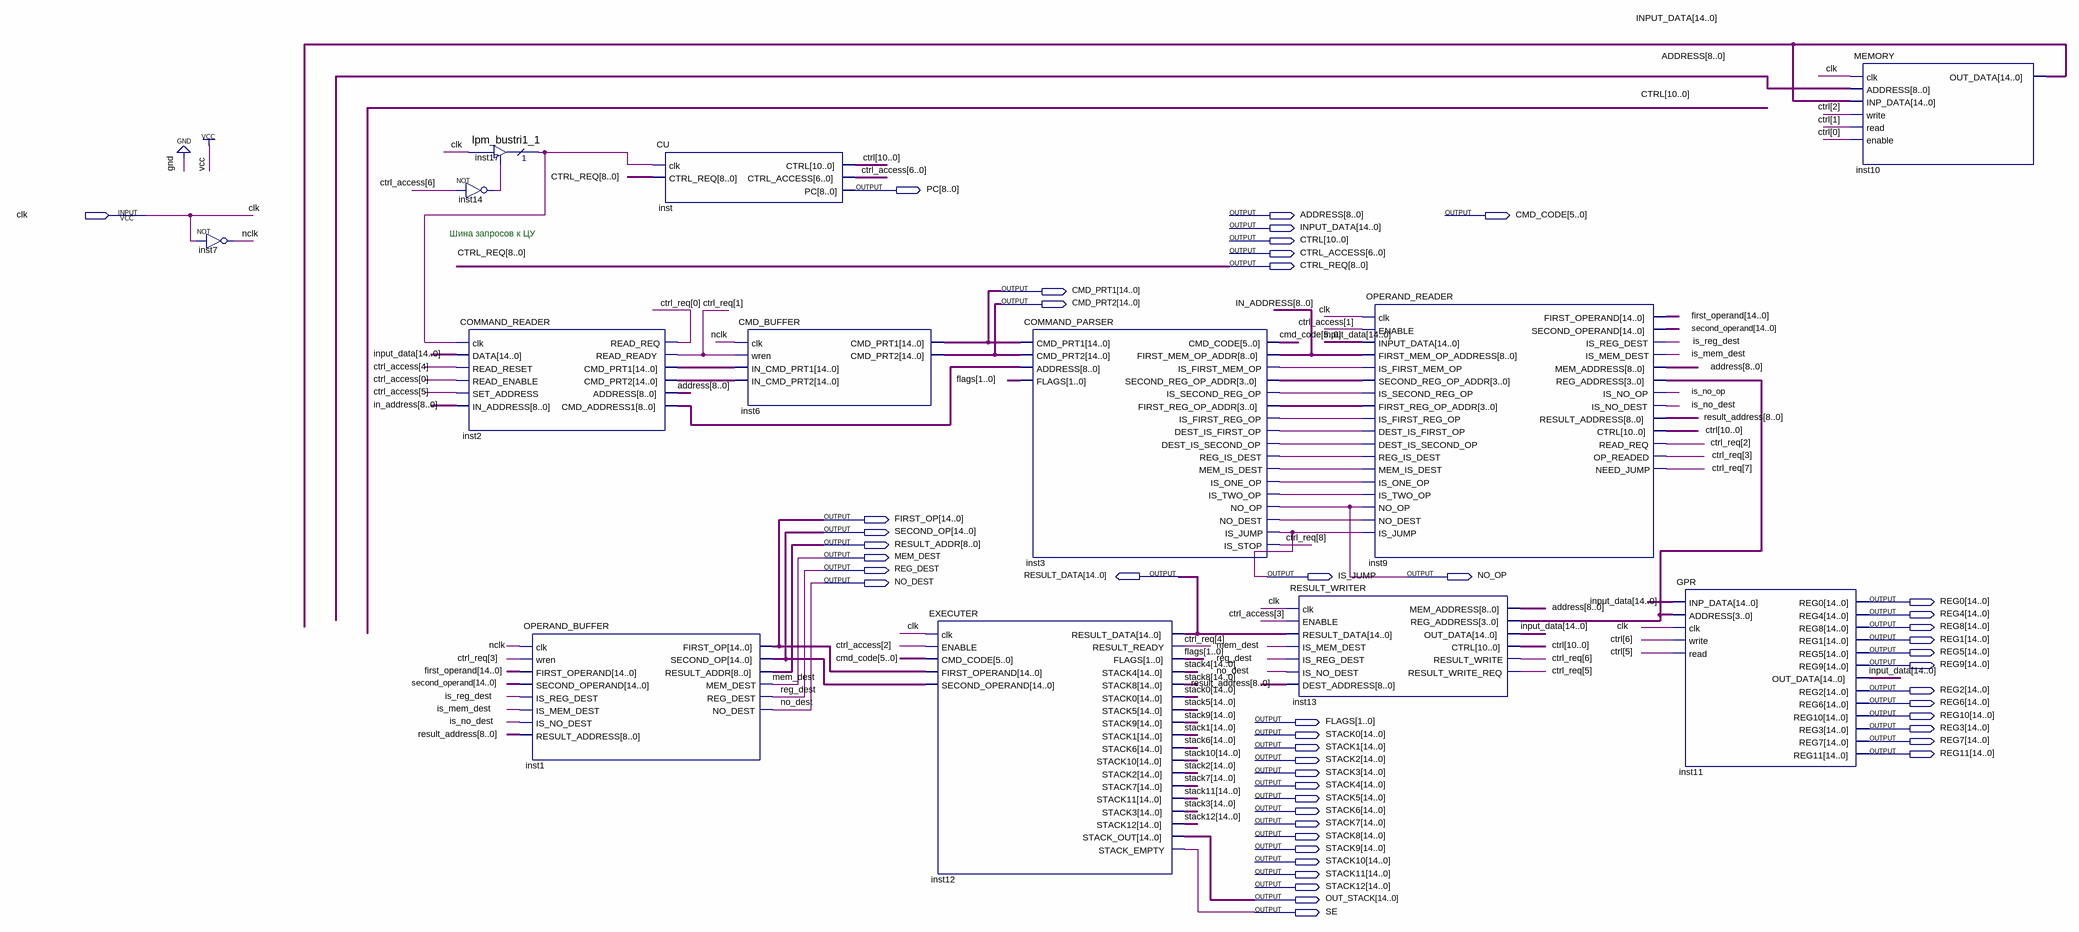
[diagram p0: schematic sheet]
// Quartus schematic MICROPROCESSOR.bdf as structural Verilog: 13 symbols, 47 pins
module MICROPROCESSOR (
  input  clk,
  output [8:0] PC,
  output [8:0] ADDRESS,
  output [5:0] CMD_CODE,
  output [14:0] INPUT_DATA,
  output [10:0] CTRL,
  output [6:0] CTRL_ACCESS,
  output [8:0] CTRL_REQ,
  output [14:0] CMD_PRT1,
  output [14:0] CMD_PRT2,
  output [14:0] FIRST_OP,
  output [14:0] SECOND_OP,
  output [8:0] RESULT_ADDR,
  output MEM_DEST,
  output REG_DEST,
  output [14:0] RESULT_DATA,
  output IS_JUMP,
  output NO_OP,
  output NO_DEST,
  output [14:0] REG0,
  output [14:0] REG4,
  output [14:0] REG8,
  output [14:0] REG1,
  output [14:0] REG5,
  output [14:0] REG9,
  output [14:0] REG2,
  output [14:0] REG6,
  output [14:0] REG10,
  output [1:0] FLAGS,
  output [14:0] REG3,
  output [14:0] STACK0,
  output [14:0] REG7,
  output [14:0] STACK1,
  output [14:0] REG11,
  output [14:0] STACK2,
  output [14:0] STACK3,
  output [14:0] STACK4,
  output [14:0] STACK5,
  output [14:0] STACK6,
  output [14:0] STACK7,
  output [14:0] STACK8,
  output [14:0] STACK9,
  output [14:0] STACK10,
  output [14:0] STACK11,
  output [14:0] STACK12,
  output [14:0] OUT_STACK,
  output SE
);

  wire inst3_dest_is_first_op, inst3_dest_is_second_op, inst3_is_first_mem_op, inst3_is_first_reg_op,
       inst3_is_one_op, inst3_is_second_reg_op, inst3_is_two_op, inst3_mem_is_dest, inst3_no_dest,
       inst3_reg_is_dest, inst14_out, inst17_tridata, is_mem_dest, is_no_dest, is_no_op, is_reg_dest, nclk;
  wire [3:0] inst3_first_reg_op_addr, inst3_second_reg_op_addr, inst13_reg_address;
  wire [8:0] IN_ADDRESS, inst2_cmd_address1, result_address;
  wire [14:0] first_operand, inst2_cmd_prt1, inst2_cmd_prt2, second_operand;

  not inst7 (nclk, clk);
  not inst14 (inst14_out, CTRL_ACCESS[6]);
  COMMAND_READER inst2 (
    .clk(inst17_tridata), .DATA(INPUT_DATA), .READ_RESET(CTRL_ACCESS[4]), .READ_ENABLE(CTRL_ACCESS[0]),
    .SET_ADDRESS(CTRL_ACCESS[5]), .IN_ADDRESS(IN_ADDRESS), .READ_REQ(CTRL_REQ[0]), .READ_READY(CTRL_REQ[1]),
    .CMD_PRT1(inst2_cmd_prt1), .CMD_PRT2(inst2_cmd_prt2), .ADDRESS(ADDRESS), .CMD_ADDRESS1(inst2_cmd_address1));
  lpm_bustri1_1 inst17 (.enabledt(inst14_out), .data(clk), .tridata(inst17_tridata));
  OPERAND_BUFFER inst1 (
    .clk(nclk), .wren(CTRL_REQ[3]), .FIRST_OPERAND(first_operand), .SECOND_OPERAND(second_operand),
    .IS_REG_DEST(is_reg_dest), .IS_MEM_DEST(is_mem_dest), .IS_NO_DEST(is_no_dest),
    .RESULT_ADDRESS(result_address), .FIRST_OP(FIRST_OP), .SECOND_OP(SECOND_OP), .RESULT_ADDR(RESULT_ADDR),
    .MEM_DEST(MEM_DEST), .REG_DEST(REG_DEST), .NO_DEST(NO_DEST));
  CU inst (.clk(inst17_tridata), .CTRL_REQ(CTRL_REQ), .CTRL(CTRL), .CTRL_ACCESS(CTRL_ACCESS), .PC(PC));
  CMD_BUFFER inst6 (
    .clk(nclk), .wren(CTRL_REQ[1]), .IN_CMD_PRT1(inst2_cmd_prt1), .IN_CMD_PRT2(inst2_cmd_prt2),
    .CMD_PRT1(CMD_PRT1), .CMD_PRT2(CMD_PRT2));
  EXECUTER inst12 (
    .clk(clk), .ENABLE(CTRL_ACCESS[2]), .CMD_CODE(CMD_CODE), .FIRST_OPERAND(FIRST_OP),
    .SECOND_OPERAND(SECOND_OP), .RESULT_DATA(RESULT_DATA), .RESULT_READY(CTRL_REQ[4]), .FLAGS(FLAGS),
    .STACK4(STACK4), .STACK8(STACK8), .STACK0(STACK0), .STACK5(STACK5), .STACK9(STACK9), .STACK1(STACK1),
    .STACK6(STACK6), .STACK10(STACK10), .STACK2(STACK2), .STACK7(STACK7), .STACK11(STACK11), .STACK3(STACK3),
    .STACK12(STACK12), .STACK_OUT(OUT_STACK), .STACK_EMPTY(SE));
  COMMAND_PARSER inst3 (
    .CMD_PRT1(CMD_PRT1), .CMD_PRT2(CMD_PRT2), .ADDRESS(inst2_cmd_address1), .FLAGS(FLAGS),
    .CMD_CODE(CMD_CODE), .FIRST_MEM_OP_ADDR(IN_ADDRESS), .IS_FIRST_MEM_OP(inst3_is_first_mem_op),
    .SECOND_REG_OP_ADDR(inst3_second_reg_op_addr), .IS_SECOND_REG_OP(inst3_is_second_reg_op),
    .FIRST_REG_OP_ADDR(inst3_first_reg_op_addr), .IS_FIRST_REG_OP(inst3_is_first_reg_op),
    .DEST_IS_FIRST_OP(inst3_dest_is_first_op), .DEST_IS_SECOND_OP(inst3_dest_is_second_op),
    .REG_IS_DEST(inst3_reg_is_dest), .MEM_IS_DEST(inst3_mem_is_dest), .IS_ONE_OP(inst3_is_one_op),
    .IS_TWO_OP(inst3_is_two_op), .NO_OP(NO_OP), .NO_DEST(inst3_no_dest), .IS_JUMP(IS_JUMP),
    .IS_STOP(CTRL_REQ[8]));
  RESULT_WRITER inst13 (
    .clk(clk), .ENABLE(CTRL_ACCESS[3]), .RESULT_DATA(RESULT_DATA), .IS_MEM_DEST(MEM_DEST),
    .IS_REG_DEST(REG_DEST), .IS_NO_DEST(NO_DEST), .DEST_ADDRESS(result_address), .MEM_ADDRESS(ADDRESS),
    .REG_ADDRESS(inst13_reg_address), .OUT_DATA(INPUT_DATA), .CTRL(CTRL), .RESULT_WRITE(CTRL_REQ[6]),
    .RESULT_WRITE_REQ(CTRL_REQ[5]));
  OPERAND_READER inst9 (
    .clk(clk), .ENABLE(CTRL_ACCESS[1]), .INPUT_DATA(INPUT_DATA), .FIRST_MEM_OP_ADDRESS(IN_ADDRESS),
    .IS_FIRST_MEM_OP(inst3_is_first_mem_op), .SECOND_REG_OP_ADDR(inst3_second_reg_op_addr),
    .IS_SECOND_REG_OP(inst3_is_second_reg_op), .FIRST_REG_OP_ADDR(inst3_first_reg_op_addr),
    .IS_FIRST_REG_OP(inst3_is_first_reg_op), .DEST_IS_FIRST_OP(inst3_dest_is_first_op),
    .DEST_IS_SECOND_OP(inst3_dest_is_second_op), .REG_IS_DEST(inst3_reg_is_dest),
    .MEM_IS_DEST(inst3_mem_is_dest), .IS_ONE_OP(inst3_is_one_op), .IS_TWO_OP(inst3_is_two_op), .NO_OP(NO_OP),
    .NO_DEST(inst3_no_dest), .IS_JUMP(IS_JUMP), .FIRST_OPERAND(first_operand),
    .SECOND_OPERAND(second_operand), .IS_REG_DEST(is_reg_dest), .IS_MEM_DEST(is_mem_dest),
    .MEM_ADDRESS(ADDRESS), .REG_ADDRESS(inst13_reg_address), .IS_NO_OP(is_no_op), .IS_NO_DEST(is_no_dest),
    .RESULT_ADDRESS(result_address), .CTRL(CTRL), .READ_REQ(CTRL_REQ[2]), .OP_READED(CTRL_REQ[3]),
    .NEED_JUMP(CTRL_REQ[7]));
  GPR inst11 (
    .INP_DATA(INPUT_DATA), .ADDRESS(inst13_reg_address), .clk(clk), .write(CTRL[6]), .read(CTRL[5]),
    .REG0(REG0), .REG4(REG4), .REG8(REG8), .REG1(REG1), .REG5(REG5), .REG9(REG9), .OUT_DATA(INPUT_DATA),
    .REG2(REG2), .REG6(REG6), .REG10(REG10), .REG3(REG3), .REG7(REG7), .REG11(REG11));
  MEMORY inst10 (
    .clk(clk), .ADDRESS(ADDRESS), .INP_DATA(INPUT_DATA), .write(CTRL[2]), .read(CTRL[1]), .enable(CTRL[0]),
    .OUT_DATA(INPUT_DATA));

  // Notes on the sheet:
  //   Шина запросов к ЦУ
endmodule
